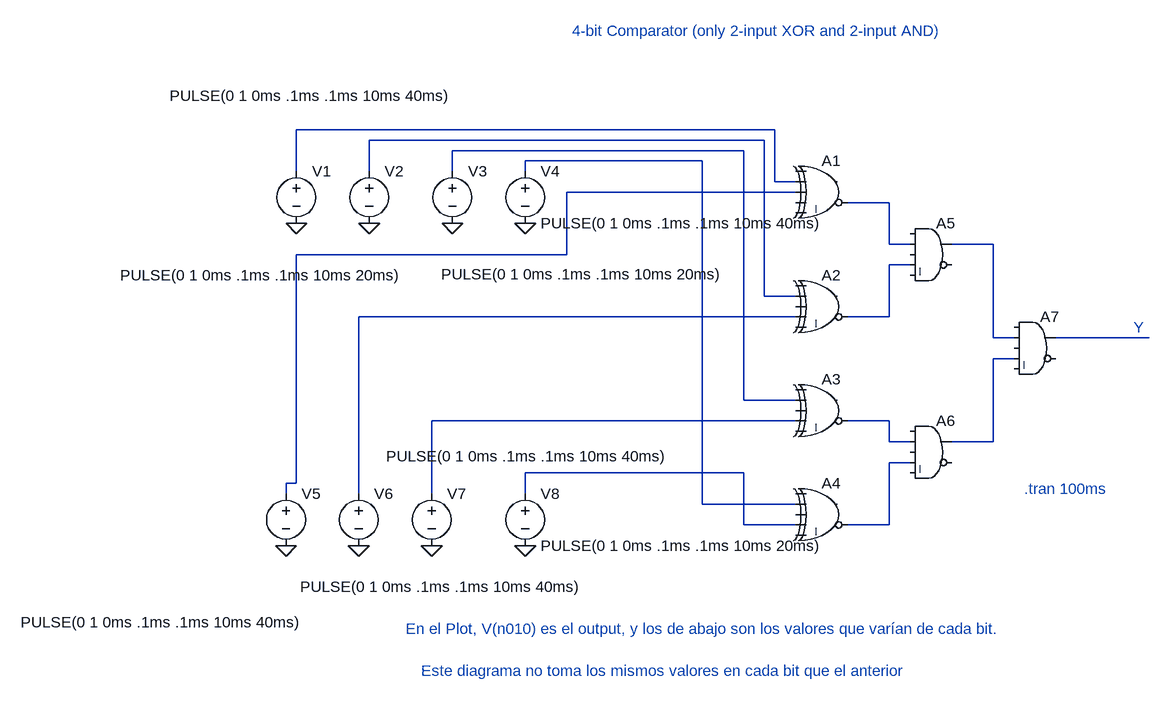
[diagram p0: schematic Lab_01_12.asc]
Lab_01_12.asc, the LTspice schematic file:
Version 4
SHEET 1 880 816
WIRE 64 -32 -672 -32
WIRE 48 -16 -560 -16
WIRE 16 0 -432 0
WIRE -48 16 -320 16
WIRE -672 32 -672 -32
WIRE -560 32 -560 -16
WIRE -432 32 -432 0
WIRE -320 32 -320 16
WIRE 64 48 64 -32
WIRE 96 48 64 48
WIRE 96 64 -256 64
WIRE 240 80 176 80
WIRE 240 144 240 80
WIRE 272 144 240 144
WIRE 400 144 336 144
WIRE -256 160 -256 64
WIRE -256 160 -672 160
WIRE 272 176 240 176
WIRE 48 224 48 -16
WIRE 96 224 48 224
WIRE 96 256 -576 256
WIRE 240 256 240 176
WIRE 240 256 176 256
WIRE 400 288 400 144
WIRE 432 288 400 288
WIRE 640 288 496 288
WIRE 432 320 400 320
WIRE 16 384 16 0
WIRE 96 384 16 384
WIRE 96 416 -464 416
WIRE 240 416 176 416
WIRE 240 448 240 416
WIRE 272 448 240 448
WIRE 400 448 400 320
WIRE 400 448 336 448
WIRE 272 480 240 480
WIRE 16 496 -320 496
WIRE -672 512 -672 160
WIRE -672 512 -688 512
WIRE -688 528 -688 512
WIRE -576 528 -576 256
WIRE -464 528 -464 416
WIRE -320 528 -320 496
WIRE -48 544 -48 16
WIRE 96 544 -48 544
WIRE 16 576 16 496
WIRE 96 576 16 576
WIRE 240 576 240 480
WIRE 240 576 176 576
FLAG -672 112 0
FLAG -560 112 0
FLAG -432 112 0
FLAG -320 112 0
FLAG -688 608 0
FLAG -576 608 0
FLAG -464 608 0
FLAG -320 608 0
SYMBOL Digital\\xor 144 0 R0
SYMATTR InstName A1
SYMBOL Digital\\xor 144 176 R0
SYMATTR InstName A2
SYMBOL Digital\\xor 144 336 R0
SYMATTR InstName A3
SYMBOL Digital\\xor 144 496 R0
SYMATTR InstName A4
SYMBOL Digital\\and 304 96 R0
SYMATTR InstName A5
SYMBOL Digital\\and 304 400 R0
SYMATTR InstName A6
SYMBOL Digital\\and 464 240 R0
SYMATTR InstName A7
SYMBOL voltage -672 16 R0
WINDOW 3 -271 176 Left 2
WINDOW 123 0 0 Left 0
WINDOW 39 0 0 Left 0
SYMATTR Value PULSE(0 1 0ms .1ms .1ms 10ms 20ms)
SYMATTR InstName V1
SYMBOL voltage -560 16 R0
WINDOW 3 -307 -100 Left 2
WINDOW 123 0 0 Left 0
WINDOW 39 0 0 Left 0
SYMATTR Value PULSE(0 1 0ms .1ms .1ms 10ms 40ms)
SYMATTR InstName V2
SYMBOL voltage -432 16 R0
WINDOW 3 -17 174 Left 2
WINDOW 123 0 0 Left 0
WINDOW 39 0 0 Left 0
SYMATTR Value PULSE(0 1 0ms .1ms .1ms 10ms 20ms)
SYMATTR InstName V3
SYMBOL voltage -320 16 R0
WINDOW 123 0 0 Left 0
WINDOW 39 0 0 Left 0
SYMATTR InstName V4
SYMATTR Value PULSE(0 1 0ms .1ms .1ms 10ms 40ms)
SYMBOL voltage -688 512 R0
WINDOW 3 -408 214 Left 2
WINDOW 123 0 0 Left 0
WINDOW 39 0 0 Left 0
SYMATTR Value PULSE(0 1 0ms .1ms .1ms 10ms 40ms)
SYMATTR InstName V5
SYMBOL voltage -576 512 R0
WINDOW 3 -90 159 Left 2
WINDOW 123 0 0 Left 0
WINDOW 39 0 0 Left 0
SYMATTR Value PULSE(0 1 0ms .1ms .1ms 10ms 40ms)
SYMATTR InstName V6
SYMBOL voltage -464 512 R0
WINDOW 3 -70 -42 Left 2
WINDOW 123 0 0 Left 0
WINDOW 39 0 0 Left 0
SYMATTR Value PULSE(0 1 0ms .1ms .1ms 10ms 40ms)
SYMATTR InstName V7
SYMBOL voltage -320 512 R0
WINDOW 123 0 0 Left 0
WINDOW 39 0 0 Left 0
SYMATTR InstName V8
SYMATTR Value PULSE(0 1 0ms .1ms .1ms 10ms 20ms)
TEXT 616 272 Left 2 ;Y
TEXT 448 520 Left 2 ;.tran 100ms
TEXT -248 -184 Left 2 ;4-bit Comparator (only 2-input XOR and 2-input AND)
TEXT -504 736 Left 2 ;En el Plot, V(n010) es el output, y los de abajo son los valores que varían de cada bit.
TEXT -480 800 Left 2 ;Este diagrama no toma los mismos valores en cada bit que el anterior

The netlist it stands for:
* Lab_01_12.asc
A1 0 N001 N005 0 0 N006 0 0 XOR
A2 0 N002 0 N009 0 N008 0 0 XOR
A3 0 N003 0 N012 0 N013 0 0 XOR
A4 0 N004 0 N015 0 N014 0 0 XOR
A5 0 N006 0 N008 0 0 N007 0 AND
A6 0 N013 0 N014 0 0 N011 0 AND
A7 0 N007 0 N011 0 0 N010 0 AND
V1 N001 0 PULSE(0 1 0ms .1ms .1ms 10ms 20ms)
V2 N002 0 PULSE(0 1 0ms .1ms .1ms 10ms 40ms)
V3 N003 0 PULSE(0 1 0ms .1ms .1ms 10ms 20ms)
V4 N004 0 PULSE(0 1 0ms .1ms .1ms 10ms 40ms)
V5 N005 0 PULSE(0 1 0ms .1ms .1ms 10ms 40ms)
V6 N009 0 PULSE(0 1 0ms .1ms .1ms 10ms 40ms)
V7 N012 0 PULSE(0 1 0ms .1ms .1ms 10ms 40ms)
V8 N015 0 PULSE(0 1 0ms .1ms .1ms 10ms 20ms)
* Y
* .tran 100ms
* 4-bit Comparator (only 2-input XOR and 2-input AND)
* En el Plot, V(n010) es el output, y los de abajo son los valores que varían de cada bit.
* Este diagrama no toma los mismos valores en cada bit que el anterior
.backanno
.end